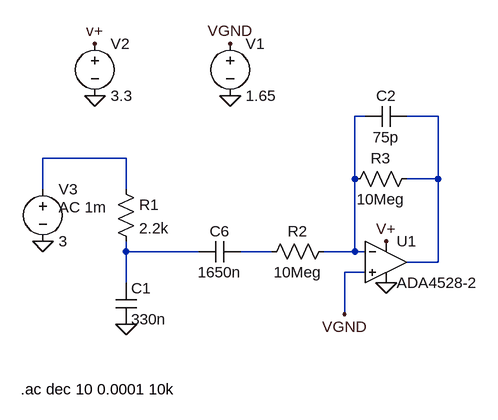
[diagram p0: schematic input filter.asc]
input filter.asc, the LTspice schematic file:
Version 4
SHEET 1 880 680
WIRE 544 -624 528 -624
WIRE 656 -624 608 -624
WIRE 176 -560 48 -560
WIRE 528 -528 528 -624
WIRE 656 -528 656 -624
WIRE 656 -528 608 -528
WIRE 48 -512 48 -560
WIRE 176 -512 176 -560
WIRE 176 -416 176 -432
WIRE 288 -416 176 -416
WIRE 400 -416 352 -416
WIRE 528 -416 528 -528
WIRE 528 -416 480 -416
WIRE 544 -416 528 -416
WIRE 656 -400 656 -528
WIRE 656 -400 608 -400
WIRE 544 -384 512 -384
WIRE 176 -368 176 -416
WIRE 512 -320 512 -384
FLAG 176 -304 0
FLAG 576 -368 0
FLAG 128 -656 0
FLAG 336 -656 0
FLAG 128 -736 v+
FLAG 336 -736 VGND
FLAG 512 -320 VGND
FLAG 576 -432 V+
FLAG 48 -432 0
SYMBOL cap 160 -368 R0
SYMATTR InstName C1
SYMATTR Value 330n
SYMBOL cap 352 -432 R90
WINDOW 0 0 32 VBottom 2
WINDOW 3 32 32 VTop 2
SYMATTR InstName C6
SYMATTR Value 1650n
SYMBOL res 160 -528 R0
SYMATTR InstName R1
SYMATTR Value 2.2k
SYMBOL OpAmps\\ADA4528-2 576 -464 R0
SYMATTR InstName U1
SYMBOL res 496 -432 R90
WINDOW 0 0 56 VBottom 2
WINDOW 3 32 56 VTop 2
SYMATTR InstName R2
SYMATTR Value 10Meg
SYMBOL res 624 -544 R90
WINDOW 0 0 56 VBottom 2
WINDOW 3 32 56 VTop 2
SYMATTR InstName R3
SYMATTR Value 10Meg
SYMBOL voltage 336 -752 R0
WINDOW 123 0 0 Left 0
WINDOW 39 0 0 Left 0
SYMATTR InstName V1
SYMATTR Value 1.65
SYMBOL voltage 128 -752 R0
WINDOW 123 0 0 Left 0
WINDOW 39 0 0 Left 0
SYMATTR InstName V2
SYMATTR Value 3.3
SYMBOL cap 608 -640 R90
WINDOW 0 0 32 VBottom 2
WINDOW 3 32 32 VTop 2
SYMATTR InstName C2
SYMATTR Value 75p
SYMBOL voltage 48 -528 R0
WINDOW 123 24 44 Left 2
WINDOW 39 0 0 Left 0
SYMATTR InstName V3
SYMATTR Value 3
SYMATTR Value2 AC 1m
TEXT 14 -204 Left 2 !.ac dec 10 0.0001 10k

The netlist it stands for:
* input filter.asc
C1 N004 0 330n
C6 N005 N004 1650n
R1 N003 N004 2.2k
XU1 VGND N001 v+ 0 N002 ADA4528-2  ; pins In+ In- V+ V- OUT
R2 N001 N005 10Meg
R3 N002 N001 10Meg
V1 VGND 0 1.65
V2 v+ 0 3.3
C2 N002 N001 75p
V3 N003 0 3 AC 1m
.ac dec 10 0.0001 10k
.backanno
.end